# Altium schematic sheet Transistor_Driver.SchDoc
size B; Author: AM; CompanyName: Expatria Technologies; DrawnBy: A.Marles; Engineer: AM; Organization: Expatria Technolgoies; Address1: PO Box 2084; Address3: Merritt, BC V1K 1B8; Address4: Canada; DocumentNumber: 19; Revision: A2; SheetNumber: 16; SheetTotal: 26
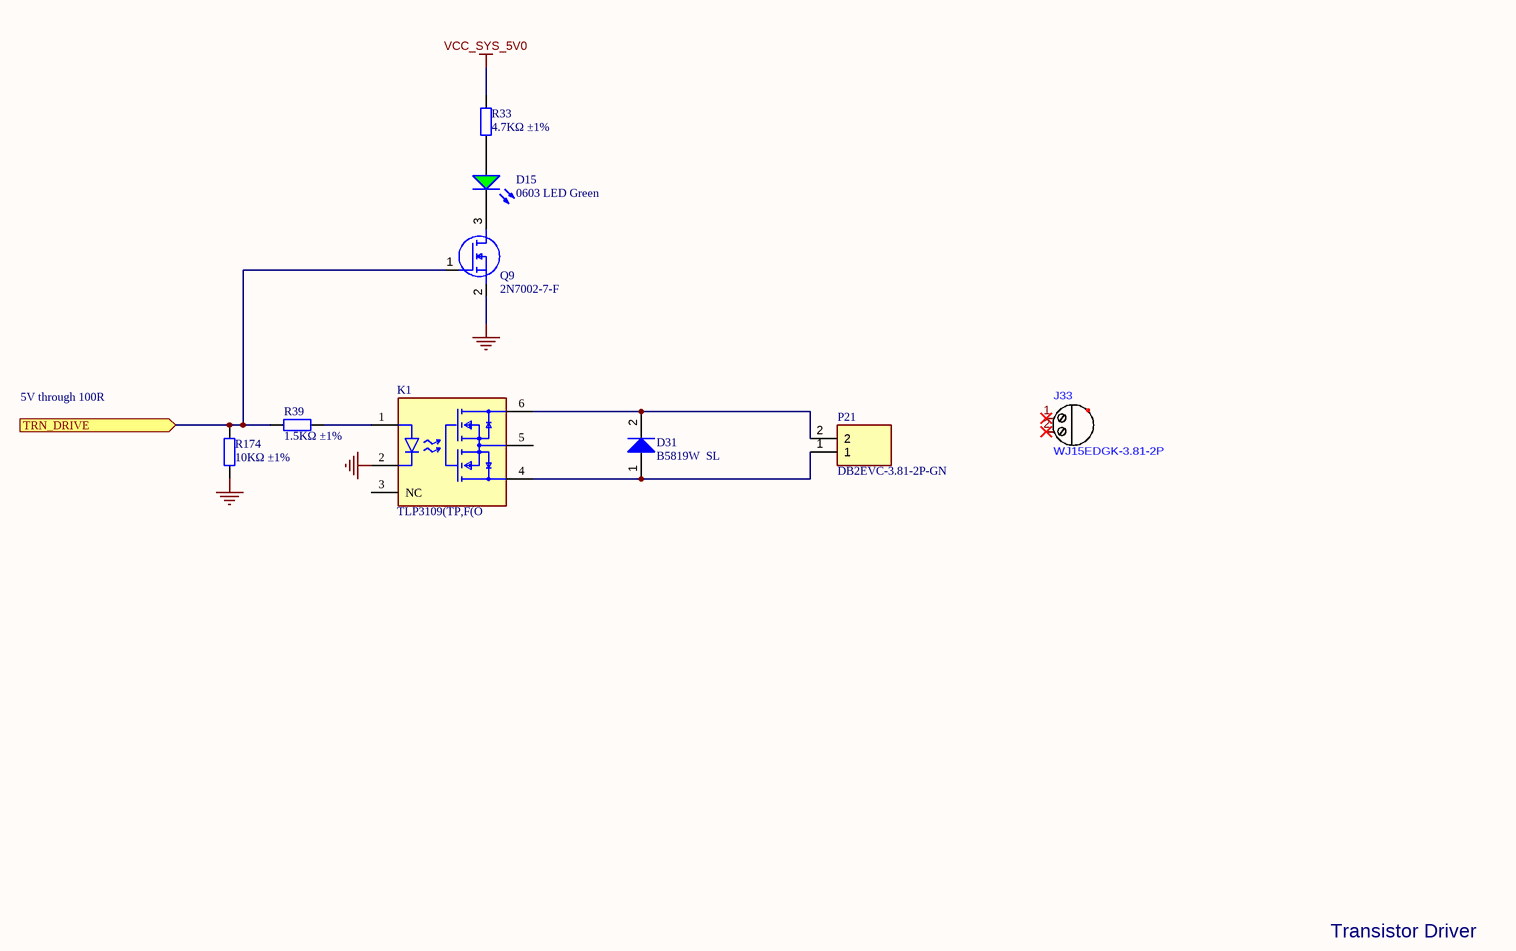
[diagram p0: Transistor_Driver.SchDoc]

## Parts
D15  0603 LED Green  [0603_LED_S1 - GREEN]
D31  B5819W  SL  [SOD-123]
J33  WJ15EDGK-3.81-2P  (mechanical)
K1  TLP3109(TP,F(O  [FP-11-7C1S-MFG]
P21  DB2EVC-3.81-2P-GN  [CONN-TH_5P-P3.81_DB2EVC-3.81-2p]
Q9  2N7002-7-F  [SOT-23(SOT-23-3)]
R33  4.7KΩ ±1%  [0402_R]
R39  1.5KΩ ±1%  [0402_R]
R174  10KΩ ±1%  [0402_R]

## Ports
TRN_DRIVE (in)

## Nets
GND: K1.2(C) Q9.2(S) R174.1
VCC_SYS_5V0: R33.2
TRN_DRIVE: Q9.1(G) R39.1 R174.2 ; port TRN_DRIVE
NetD15_A: D15.A R33.1
NetD15_K: D15.K Q9.3(D)
NetD31_1: D31.1(A) K1.4(Drain) P21.1
NetD31_2: D31.2(K) K1.6(Drain) P21.2
NetK1_1: K1.1(A) R39.2

Not connected (* = marked no-connect by the designer): J33 1* 2*; K1 3(NC) 5(Source)

## Notes on the sheet
- 5V through 100R
- Transistor Driver
- SHEET
- Expatria Technologies
- 625 Kane Valley Rd.
- Box 2084
- Merritt, BC V1K1B8
- PROJECT
- SIZE
- ENGR
- MODIFIED
- DOCUMENT
- REV
- Copyright Sienci Labs 2024. This document describes Open Hardware and is licensed under the CERN-OHL-S v2. No warranty is implied or expressed.
- EMAIL: INFO@EXPATRIA.CA
- B
- /

## Library data of the parts
D15 = 19-217/GHC-YR1S2/3T: Colorless transparence -40℃~+85℃ 520nm~535nm Emerald 120° 110mW 0603 Light Emitting Diodes (LED) ROHS; Manufacturer: Everlight Elec; Package: 0603; Supplier: LC; SuppliersPartNumber: C72043; Color: Green; Manufacturer Part Number: 19-217/GHC-YR1S2/3T
D31 = SOD-123 B5819W  SL: Schottky Diode; Manufacturer: Jiangsu Changjing Electronics Technology; ComponentLink1Description: 供应商链接; ComponentLink1URL: http://www.szlcsc.com/product/details_9093.html; Package: SOD-123; Supplier: LCSC; SuppliersPartNumber: C8598; Manufacturer Part Number: B5819W SL
J33 = WJ15EDGK-3.81-2P: 2 1 3.81mm Green Plug P=3.81mm Pluggable System Terminal Block ROHS; Manufacturer: Ningbo; Supplier: LCSC; Supplier Part Number 1: C8466; Manufacturer Part Number: WJ15EDGK-3.81-2P; RoHS: Yes; SuppliersPartNumber: C8466
K1 = TLP3109(TP,F(O: Form A(SPST-NO) 1.33V 100V 45mΩ 2A DC SMD-6P Solid State Relays - MOS Output (PhotoMOS) ROHS; Manufacturer: Toshiba; Manufacturer Part Number: TLP3109(TP,F(O; SuppliersPartNumber: C393897
P21 = DB2EVC-3.81-2P-GN: 3.81mm Green Board Edge/Receptacle-Close Push-Pull,P=3.81mm Pluggable System Terminal Block ROHS; Manufacturer: DIBO; SuppliersPartNumber: C395686; Manufacturer Part Number: DB2EVC-3.81-2P-GN; Supplier: LCSC; Value: DB2EVC-3.81-2P-GN
Q9 = 2N7002-7-F: 60V 115mA 7.5Ω@5V,50mA 370mW N Channel SOT-23 MOSFETs ROHS; Manufacturer: Diodes Inc.; SuppliersPartNumber: C85049; Manufacturer Part Number: 2N7002-7-F; Value: 2N7002-7-F; Datasheet Link: https://datasheet.datasheetarchive.com/originals/distributors/SFDatasheet-0/sf-0003625.pdf; Height: 1.2mm; Manufacturer_Part_Number: 2N7002-7-F; Mouser Part Number: 621-2N7002-F; Mouser Price/Stock: https://www.mouser.co.uk/ProductDetail/Diodes-Incorporated/2N7002-7-F?qs=jMXWnm70%252BC%252BAX%252BMLzUkTZg%3D%3D; Arrow Part Number: 2N7002-7-F; Arrow Price/Stock: https://www.arrow.com/en/products/2n7002-7-f/diodes-incorporated?region=nac
R33 = 0402 4.7K (4701) 1%: Chip resistor; Manufacturer: Uniroyal Elec; Manufacturer Part Number: 0402WGF4701TCE; Power: 1/16W; ComponentLink1Description: Supplier link; ComponentLink1URL: http://www.szlcsc.com/product/details_26643.html; Package: 0402; Supplier: LCSC; SuppliersPartNumber: C25900; Resistance: 4.7KΩ; Tolerance: 1%
R39 = 0402 1.5K (1501) 1%: Chip resistor; Manufacturer: Uniroyal Elec; Manufacturer Part Number: 0402WGF1501TCE; Power: 1/16W; ComponentLink1Description: Supplier link; ComponentLink1URL: http://www.szlcsc.com/product/details_26610.html; Package: 0402; Supplier: LC; SuppliersPartNumber: C25867; Resistance: 1.5KΩ; Tolerance: 1%
R174 = 0402 10K (1002) 1%: Chip resistor; Manufacturer: Uniroyal Elec; Manufacturer Part Number: 0402WGF1002TCE; Power: 1/16W; ComponentLink1Description: Supplier link; ComponentLink1URL: http://www.szlcsc.com/product/details_26487.html; Package: 0402; Supplier: LC; SuppliersPartNumber: C25744; Resistance: 10KΩ; Tolerance: 1%